# EAGLE design LORE (EAGLE 6.5.0)
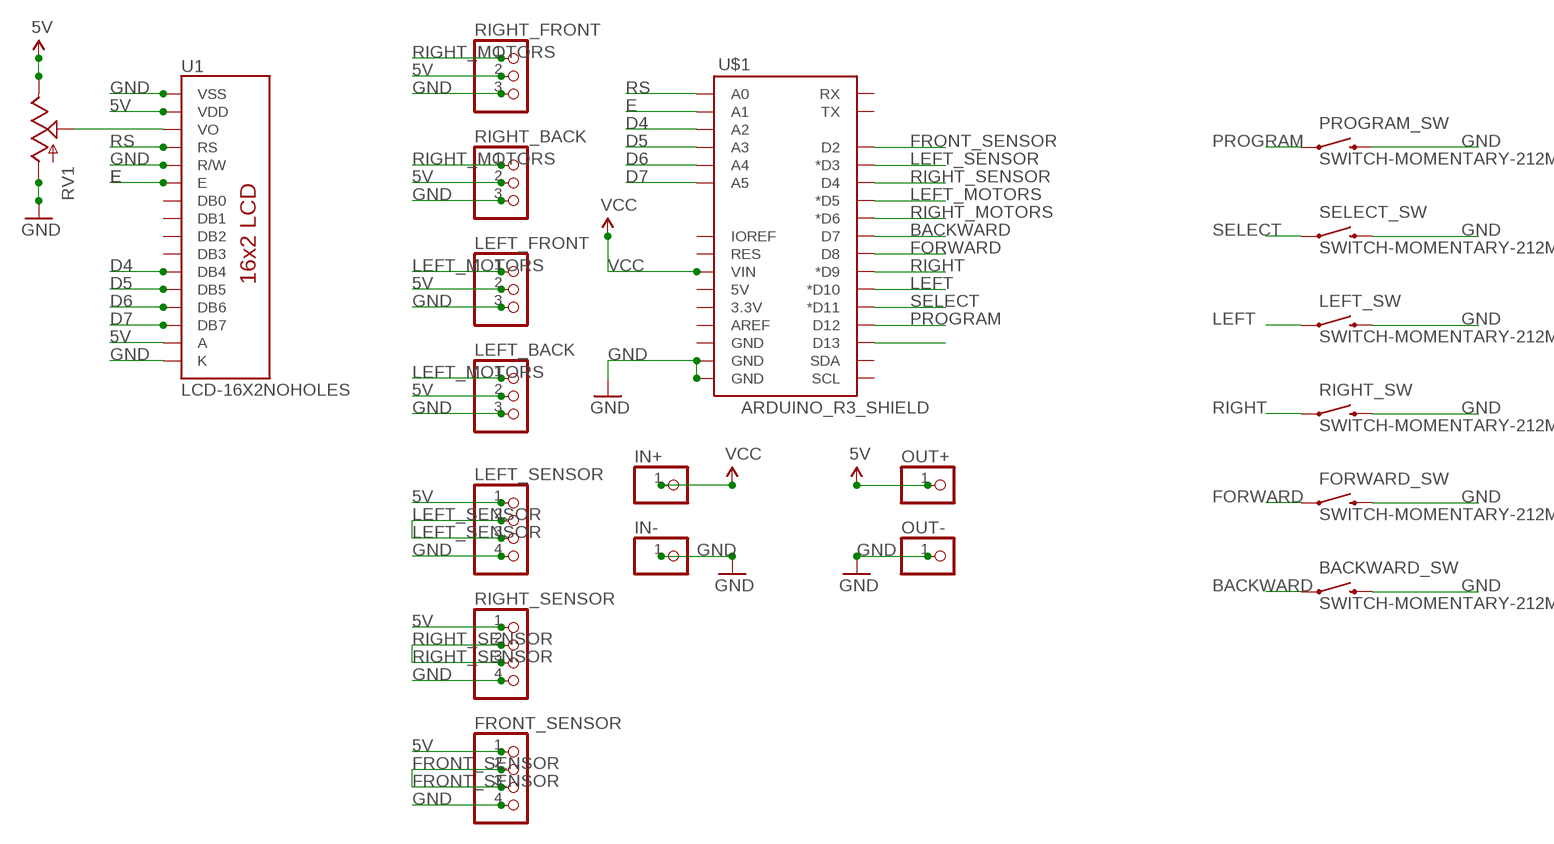
[diagram p0: schematic, sheet 1]

## Parts
BACKWARD_SW  SWITCH-MOMENTARY-212MM  [TACTILE-PTH-12MM]
FORWARD_SW  SWITCH-MOMENTARY-212MM  [TACTILE-PTH-12MM]
FRONT_SENSOR  PINHD-1X4  [1X04]
IN+  PINHD-1X1  [1X01]
IN-  PINHD-1X1  [1X01]
LEFT_BACK  PINHD-1X3  [1X03]
LEFT_FRONT  PINHD-1X3  [1X03]
LEFT_SENSOR  PINHD-1X4  [1X04]
LEFT_SW  SWITCH-MOMENTARY-212MM  [TACTILE-PTH-12MM]
OUT+  PINHD-1X1  [1X01]
OUT-  PINHD-1X1  [1X01]
PROGRAM_SW  SWITCH-MOMENTARY-212MM  [TACTILE-PTH-12MM]
RIGHT_BACK  PINHD-1X3  [1X03]
RIGHT_FRONT  PINHD-1X3  [1X03]
RIGHT_SENSOR  PINHD-1X4  [1X04]
RIGHT_SW  SWITCH-MOMENTARY-212MM  [TACTILE-PTH-12MM]
RV1  POTTRIM  [TRIM_POT]
SELECT_SW  SWITCH-MOMENTARY-212MM  [TACTILE-PTH-12MM]
U1  LCD-16X2NOHOLES  [LCD-16X2_NOHOLES]
U$1  ARDUINO_R3_SHIELD  [UNO_R3_SHIELD]

## Nets
5V: FRONT_SENSOR.1 LEFT_BACK.2 LEFT_FRONT.2 LEFT_SENSOR.1 OUT+.1 RIGHT_BACK.2 RIGHT_FRONT.2 RIGHT_SENSOR.1 RV1.2(E) U1.2(VDD) U1.15(A)
BACKWARD: BACKWARD_SW.1 U$1.D7
D4: U1.11(DB4) U$1.A2
D5: U1.12(DB5) U$1.A3
D6: U1.13(DB6) U$1.A4
D7: U1.14(DB7) U$1.A5
E: U1.6(E) U$1.A1
FORWARD: FORWARD_SW.1 U$1.D8
FRONT_SENSOR: FRONT_SENSOR.2 FRONT_SENSOR.3 U$1.D2
GND: BACKWARD_SW.3 FORWARD_SW.3 FRONT_SENSOR.4 IN-.1 LEFT_BACK.3 LEFT_FRONT.3 LEFT_SENSOR.4 LEFT_SW.3 OUT-.1 PROGRAM_SW.3 RIGHT_BACK.3 RIGHT_FRONT.3 RIGHT_SENSOR.4 RIGHT_SW.3 RV1.3(A) SELECT_SW.3 U1.1(VSS) U1.5(R/W) U1.16(K) U$1.GND@0(GND) U$1.GND@1(GND)
LEFT: LEFT_SW.1 U$1.D10(*D10)
LEFT_MOTORS: LEFT_BACK.1 LEFT_FRONT.1 U$1.D5(*D5)
LEFT_SENSOR: LEFT_SENSOR.2 LEFT_SENSOR.3 U$1.D3(*D3)
N$6: RV1.1(S) U1.3(VO)
N$12: U$1.D13
PROGRAM: PROGRAM_SW.1 U$1.D12
RIGHT: RIGHT_SW.1 U$1.D9(*D9)
RIGHT_MOTORS: RIGHT_BACK.1 RIGHT_FRONT.1 U$1.D6(*D6)
RIGHT_SENSOR: RIGHT_SENSOR.2 RIGHT_SENSOR.3 U$1.D4
RS: U1.4(RS) U$1.A0
SELECT: SELECT_SW.1 U$1.D11(*D11)
VCC: IN+.1 U$1.VIN
Unconnected: U1.7(DB0) U1.8(DB1) U1.9(DB2) U1.10(DB3) U$1.3.3V U$1.5V U$1.AREF U$1.GND@2(GND) U$1.IOREF U$1.RES U$1.RX U$1.SCL U$1.SDA U$1.TX

## Library data of the parts
BACKWARD_SW FORWARD_SW LEFT_SW PROGRAM_SW RIGHT_SW SELECT_SW = SparkFun-Electromechanical:SWITCH-MOMENTARY-2: Various NO switches- pushbuttons, reed, etc; PROD_ID: SWCH-09185
FRONT_SENSOR LEFT_SENSOR RIGHT_SENSOR = pinhead:PINHD-1X4: PIN HEADER
IN+ IN- OUT+ OUT- = pinhead:PINHD-1X1: PIN HEADER
LEFT_BACK LEFT_FRONT RIGHT_BACK RIGHT_FRONT = pinhead:PINHD-1X3: PIN HEADER
RV1 = myLibrary:POT
U1 = SparkFun-Displays:LCD-16X2: Standard text-only 16x2 parallel input LCD
U$1 = SparkFun-Boards:ARDUINO_R3_SHIELD: Shield form compatible with the Arduino Uno R3.

## Board
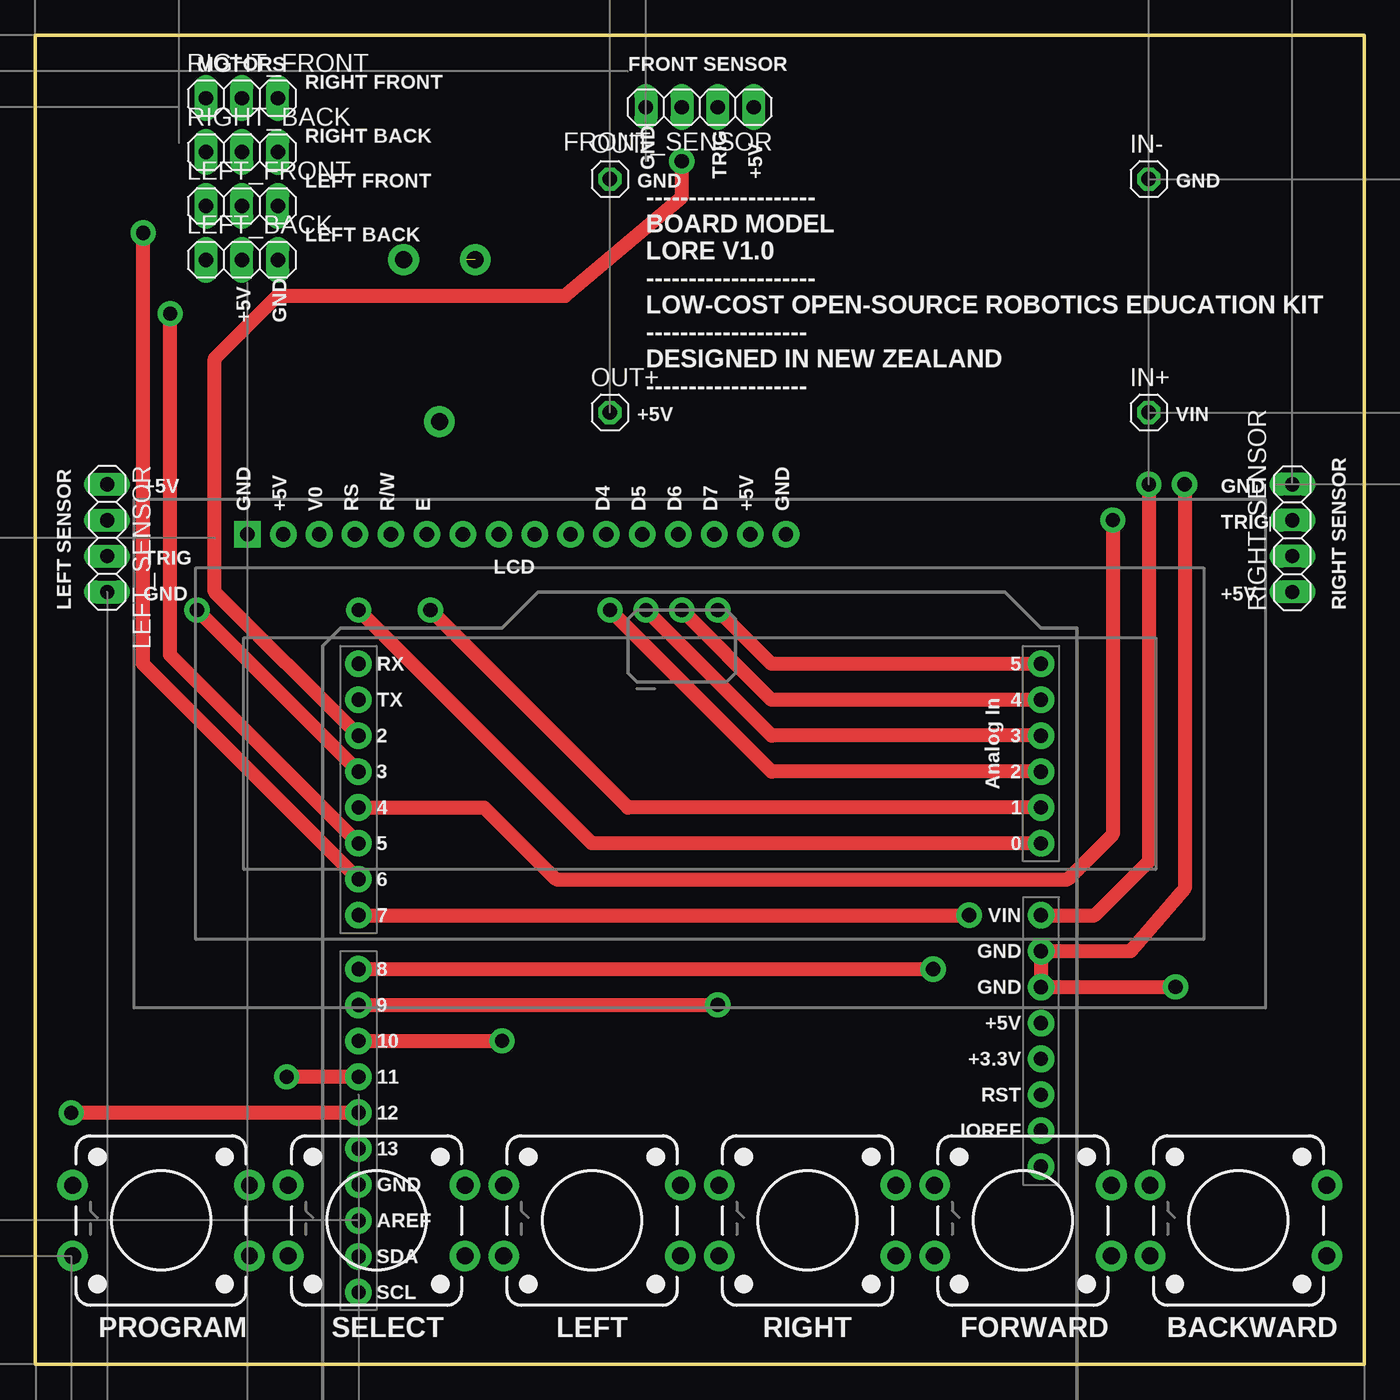
[diagram p1: board, top side]
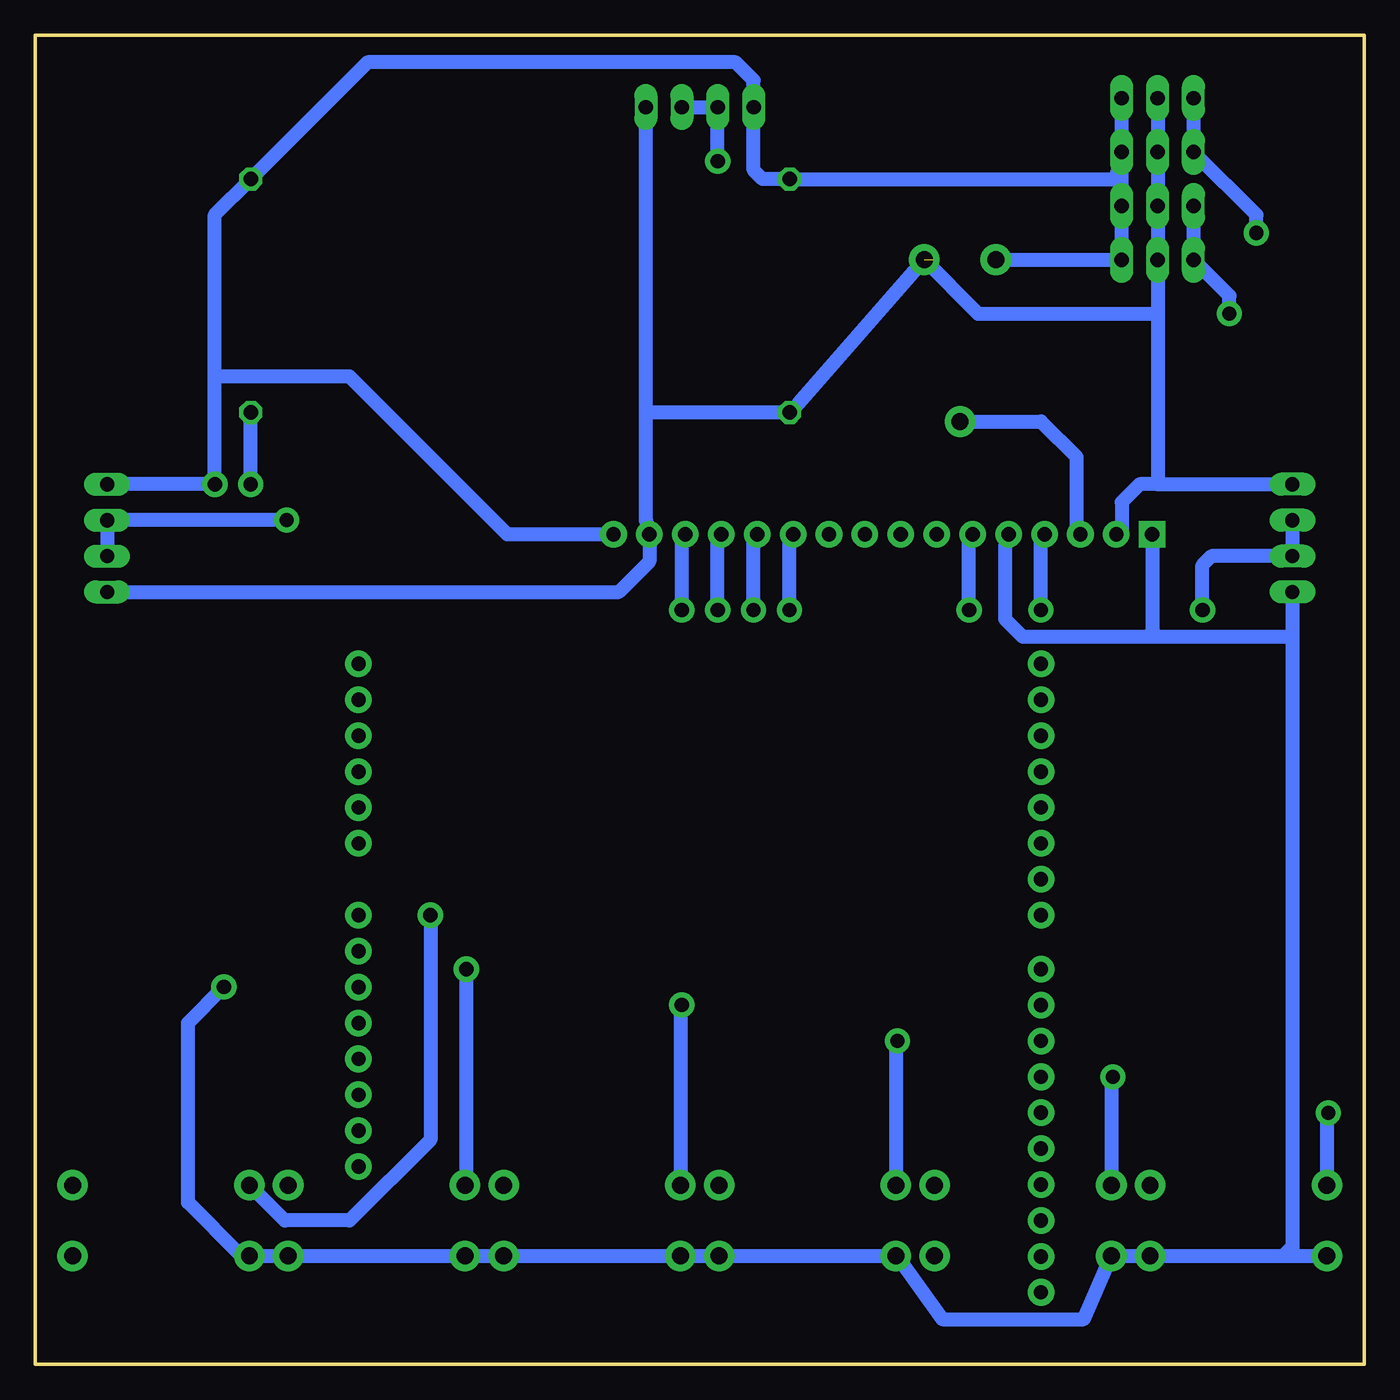
[diagram p2: board, bottom side, seen from below]

Size 93.98 x 93.98 mm. Coordinates in mm from the lower left corner, seen from the top.
Outline: 0,93.98 93.98,93.98 93.98,0 0,0 0,93.98
Copper layers (1*16): Top 0.035mm / dielectric 1.5mm / Bottom 0.035mm
Design rules "SparkFun": minimum track width 8mil, minimum drill 20mil, track to track 8mil, track to pad 8mil, pad to pad 8mil, via to via 8mil, smd to smd 8mil, copper to edge 10mil, drill to drill 8mil, minimum pad ring 12mil, minimum via ring 10mil, stop-mask expansion 4mil, vias tented up to drill 25mil, thermal gap 10mil

### Footprints (pad centres in the part's own frame; a part is rotated, then mirrored left to right if it is on the bottom)
TACTILE-PTH-12MM = drill 1.2 pad 2.159: 1 6.25,-2.5; 2 -6.25,-2.5; 3 6.25,2.5; 4 -6.25,2.5
1X04 = drill 1.016 long: 1 -3.81,0; 2 -1.27,0; 3 1.27,0; 4 3.81,0
1X01 = drill 1.016 octagon: 1 0,0
1X03 = drill 1.016 long: 1 -2.54,0; 2 0,0; 3 2.54,0
TRIM_POT = drill 1.2 pad 2.184: 1 11.43,0; 2 0,2.54; 3 0,-2.54
LCD-16X2_NOHOLES = drill 1.016 pad 1.88 square: 1 -32,15.5 | drill 1.016 pad 1.88: 2 -29.46,15.5; 3 -26.92,15.5; 4 -24.38,15.5; 5 -21.84,15.5; 6 -19.3,15.5; 7 -16.76,15.5; 8 -14.22,15.5; 9 -11.68,15.5; 10 -9.14,15.5; 11 -6.6,15.5; 12 -4.06,15.5; 13 -1.52,15.5; 14 1.02,15.5; 15 3.56,15.5; 16 6.1,15.5
UNO_R3_SHIELD = drill 1.016 pad 1.88: 3.3V 50.8,26.67; 5V 50.8,29.21; A0 50.8,41.91; A1 50.8,44.45; A2 50.8,46.99; A3 50.8,49.53; A4 50.8,52.07; A5 50.8,54.61; AREF 2.54,15.24; D2 2.54,49.53; D3 2.54,46.99; D4 2.54,44.45; D5 2.54,41.91; D6 2.54,39.37; D7 2.54,36.83; D8 2.54,33.02; D9 2.54,30.48; D10 2.54,27.94; D11 2.54,25.4; D12 2.54,22.86; D13 2.54,20.32; GND@0 50.8,31.75; GND@1 50.8,34.29; GND@2 2.54,17.78; IOREF 50.8,21.59; NC 50.8,19.05; RES 50.8,24.13; RX 2.54,54.61; SCL 2.54,10.16; SDA 2.54,12.7; TX 2.54,52.07; VIN 50.8,36.83

### Placement (x,y rotation side)
BACKWARD_SW  85.09,10.16 180 top
FORWARD_SW  69.85,10.16 180 top
FRONT_SENSOR  46.99,88.9 180 top
IN+  78.74,67.31 0 top
IN-  78.74,83.82 0 top
LEFT_BACK  14.61,78.11 0 top
LEFT_FRONT  14.61,81.92 0 top
LEFT_SENSOR  5.08,58.42 270 top
LEFT_SW  39.37,10.16 180 top
OUT+  40.64,67.31 0 top
OUT-  40.64,83.82 0 top
PROGRAM_SW  8.89,10.16 180 top
RIGHT_BACK  14.61,85.72 0 top
RIGHT_FRONT  14.61,89.53 0 top
RIGHT_SENSOR  88.9,58.42 90 top
RIGHT_SW  54.61,10.16 180 top
RV1  28.57,78.11 270 top
SELECT_SW  24.13,10.16 180 top
U1  46.99,43.18 0 top
U$1  20.32,-5.08 0 top

### Tracks (layer width: path | path; a pad name or v marks a point on that pad's centre or on a via)
5V  (1 unrouted)
  Bottom 1: RIGHT_SENSOR.1 52.72,54.61 50.55,56.77 U1.15 50.55,58.8 50.8,59.69 50.8,67.31 | RIGHT_FRONT.2 RIGHT_BACK.2 LEFT_FRONT.2 LEFT_BACK.2 14.61,74.3 | 50.8,67.31 FRONT_SENSOR.1 | 50.8,67.31 OUT+.1 40.01,67.94 RV1.2 27.3,74.3 14.61,74.3 | 14.61,74.3 14.61,62.24 | 14.61,62.24 5.71,62.24 LEFT_SENSOR.1 | 14.61,62.24 15.87,62.24 17.14,60.96 17.14,59.06 U1.2
BACKWARD  (via drill 1 pad 1.78)
  Top 1: U$1.D7 v66.04,31.75
  Bottom 1: v66.04,31.75 66.04,15.88 71.75,10.16 76.34,10.16 BACKWARD_SW.1
D4  (via drill 1 pad 1.78)
  Top 1: U$1.A2 52.07,41.91 v40.64,53.34
  Bottom 1: v40.64,53.34 40.64,58.43 U1.11
D5  (via drill 1 pad 1.78)
  Top 1: U$1.A3 52.07,44.45 v43.18,53.34
  Bottom 1: v43.18,53.34 43.18,58.43 U1.12
D6  (via drill 1 pad 1.78)
  Top 1: U$1.A4 52.07,46.99 v45.72,53.34
  Bottom 1: v45.72,53.34 45.72,58.43 U1.13
D7  (via drill 1 pad 1.78)
  Top 1: U$1.A5 52.07,49.53 v48.26,53.34
  Bottom 1: v48.26,53.34 48.26,58.43 U1.14
E  (via drill 1 pad 1.78)
  Top 1: U$1.A1 41.91,39.37 v27.94,53.34
  Bottom 1: v27.94,53.34 27.94,58.43 U1.6
FORWARD  (via drill 1 pad 1.78)
  Top 1: U$1.D8 v63.5,27.94
  Bottom 1: v63.5,27.94 63.5,12.76 FORWARD_SW.1
FRONT_SENSOR  (via drill 1 pad 1.78)
  Top 1: U$1.D2 12.7,54.61 12.7,71.12 17.14,75.56 37.47,75.56 45.72,82.55 v45.72,85.09
  Bottom 1: FRONT_SENSOR.2 FRONT_SENSOR.3 v45.72,85.09
GND  (via drill 1 pad 1.78)
  Top 1: v80.64,26.67 U$1.GND@0 U$1.GND@1 77.47,29.21 81.28,33.66 v81.28,62.23
  Bottom 0.75: 17.78,83.82 RIGHT_BACK.3 | 43.18,90.17 FRONT_SENSOR.4
  Bottom 1: 5.71,7.66 SELECT_SW.3 19.82,3.17 29.84,3.17 33.06,7.66 LEFT_SW.3 RIGHT_SW.3 FORWARD_SW.3 BACKWARD_SW.3 79.42,7.66 83.19,11.43 83.19,24.13 v80.64,26.67 | 5.71,7.66 PROGRAM_SW.3 | RIGHT_SENSOR.4 v81.28,62.23 81.28,69.85 | 81.28,69.85 81.28,81.28 IN-.1 70.48,92.08 44.45,92.08 43.18,90.81 43.18,90.17 | RIGHT_FRONT.3 RIGHT_BACK.3 17.14,83.82 | 17.14,83.82 LEFT_FRONT.3 LEFT_BACK.3 RV1.3 | U1.16 60.59,58.68 71.75,69.85 81.28,69.85 | 5.08,51.44 5.08,8.29 5.71,7.66 | LEFT_SENSOR.4 5.08,51.44 | 5.08,51.44 14.61,51.44 | 14.61,51.44 24.13,51.44 25.4,52.7 25.4,57.8 U1.5 | U1.1 14.99,51.82 14.61,51.44 | 17.14,83.82 OUT-.1 42.55,83.82 43.18,84.45 | 43.18,84.45 FRONT_SENSOR.4 43.18,84.45
LEFT  (via drill 1 pad 1.78)
  Top 1: U$1.D10 v33.02,22.86
  Bottom 1: v33.02,22.86 33.12,22.86 LEFT_SW.1
LEFT_MOTORS  (via drill 1 pad 1.78)
  Top 1: U$1.D5 9.53,50.16 v9.53,74.3
  Bottom 1: LEFT_FRONT.1 LEFT_BACK.1 9.53,75.56 v9.53,74.3
LEFT_SENSOR  (via drill 1 pad 1.78)
  Top 1: U$1.D3 v11.43,53.34
  Bottom 1: LEFT_SENSOR.2 LEFT_SENSOR.3 10.79,57.15 11.43,56.52 v11.43,53.34
N$6
  Bottom 0.75: 20.32,58.42 U1.3
  Bottom 1: 20.32,58.42 20.32,64.14 22.86,66.67 RV1.1
PROGRAM  (via drill 1 pad 1.78)
  Top 1: U$1.D12 v2.54,17.78
  Bottom 1: v2.54,17.78 2.64,17.78 PROGRAM_SW.1
RIGHT  (via drill 1 pad 1.78)
  Top 1: U$1.D9 v48.26,25.4
  Bottom 1: v48.26,25.4 48.36,25.4 RIGHT_SW.1
RIGHT_MOTORS  (via drill 1 pad 1.78)
  Top 1: U$1.D6 7.62,49.53 v7.62,80.01
  Bottom 1: RIGHT_FRONT.1 RIGHT_BACK.1 7.62,81.28 v7.62,80.01
RIGHT_SENSOR  (via drill 1 pad 1.78)
  Top 1: U$1.D4 31.75,39.37 36.83,34.29 73.03,34.29 76.2,37.47 v76.2,59.69
  Bottom 1: v76.2,59.69 RIGHT_SENSOR.3 RIGHT_SENSOR.2
RS  (via drill 1 pad 1.78)
  Top 1: U$1.A0 39.37,36.83 v22.86,53.34
  Bottom 1: v22.86,53.34 22.86,58.43 U1.4
SELECT  (via drill 1 pad 1.78)
  Top 1: U$1.D11 v17.78,20.32
  Bottom 1: v17.78,20.32 17.88,20.32 SELECT_SW.1
VCC  (via drill 1 pad 1.78)
  Top 1: U$1.VIN 74.93,31.75 78.74,35.56 v78.74,62.23
  Bottom 1: v78.74,62.23 IN+.1

### Text on the board
tPlace: MOTORS | FRONT SENSOR | RIGHT FRONT | RIGHT BACK | GND | TRIG | +5V | LEFT FRONT | GND | GND | LEFT BACK | +5V | GND | -------------------- / BOARD MODEL / LORE V1.0 / -------------------- / LOW-COST OPEN-SOURCE ROBOTICS EDUCATION KIT / ------------------- / DESIGNED IN NEW ZEALAND / ------------------- | +5V | VIN | +5V | GND | GND | +5V | V0 | RS | R/W | E | D4 | D5 | D6 | D7 | +5V | GND | TRIG | TRIG | LCD | GND | +5V | LEFT SENSOR | RIGHT SENSOR | PROGRAM | SELECT | LEFT | RIGHT | FORWARD | BACKWARD